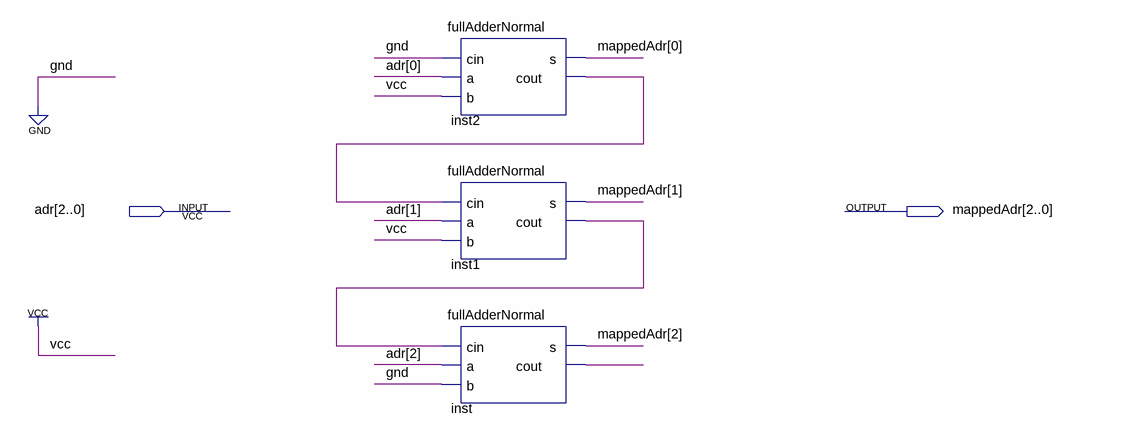
[diagram p0: schematic sheet]
// Quartus schematic mapper.bdf as structural Verilog: 3 symbols, 2 pins
module mapper (
  input  [2:0] adr,
  output [2:0] mappedAdr
);

  wire inst1_cout, inst2_cout, inst_cout;

  fullAdderNormal inst2 (.cin(1'b0), .a(adr[0]), .b(1'b1), .s(mappedAdr[0]), .cout(inst2_cout));
  fullAdderNormal inst1 (.cin(inst2_cout), .a(adr[1]), .b(1'b1), .s(mappedAdr[1]), .cout(inst1_cout));
  fullAdderNormal inst (.cin(inst1_cout), .a(adr[2]), .b(1'b0), .s(mappedAdr[2]), .cout(inst_cout));
endmodule
